# Altium schematic sheet mem.SchDoc
size A
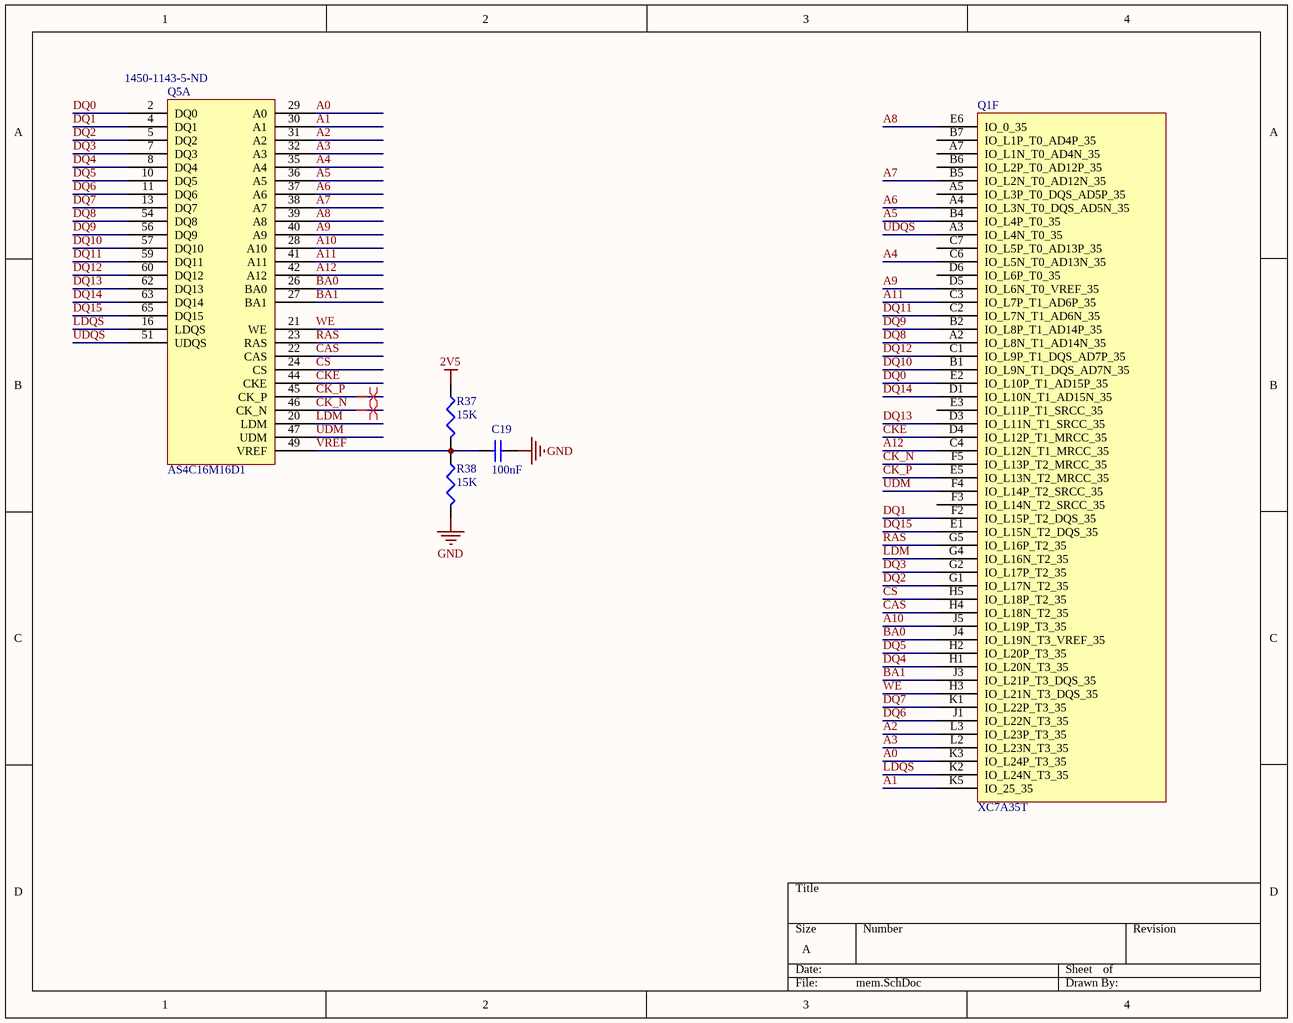
[diagram p0: mem.SchDoc]

## Parts
C19  value 100nF  [CAPC1005X06L]  (hidden comment: Cap)
Q1  XC7A35T  (part F of 6)
Q5  AS4C16M16D1  Supplier Part Number 1: 1450-1143-5-ND  [TSOP65P1180X120-66N]  (part A of 2)
R37  value 15K  [CAPC1608X90N]  (hidden comment: Res3)
R38  value 15K  [CAPC1608X90N]  (hidden comment: Res3)

## Nets
2V5: R37.1
GND: C19.2 R38.2
A0: Q1.K3(IO_L24P_T3_35) Q5.29(A0)
A1: Q1.K5(IO_25_35) Q5.30(A1)
A2: Q1.L3(IO_L23P_T3_35) Q5.31(A2)
A3: Q1.L2(IO_L23N_T3_35) Q5.32(A3)
A4: Q1.C6(IO_L5N_T0_AD13N_35) Q5.35(A4)
A5: Q1.B4(IO_L4P_T0_35) Q5.36(A5)
A6: Q1.A4(IO_L3N_T0_DQS_AD5N_35) Q5.37(A6)
A7: Q1.B5(IO_L2N_T0_AD12N_35) Q5.38(A7)
A8: Q1.E6(IO_0_35) Q5.39(A8)
A9: Q1.D5(IO_L6N_T0_VREF_35) Q5.40(A9)
A10: Q1.J5(IO_L19P_T3_35) Q5.28(A10)
A11: Q1.C3(IO_L7P_T1_AD6P_35) Q5.41(A11)
A12: Q1.C4(IO_L12N_T1_MRCC_35) Q5.42(A12)
BA0: Q1.J4(IO_L19N_T3_VREF_35) Q5.26(BA0)
BA1: Q1.J3(IO_L21P_T3_DQS_35) Q5.27(BA1)
CAS: Q1.H4(IO_L18N_T2_35) Q5.22(CAS)
CK_N: Q1.F5(IO_L13P_T2_MRCC_35) Q5.46(CK_N)
CK_P: Q1.E5(IO_L13N_T2_MRCC_35) Q5.45(CK_P)
CKE: Q1.D4(IO_L12P_T1_MRCC_35) Q5.44(CKE)
CS: Q1.H5(IO_L18P_T2_35) Q5.24(CS)
DQ0: Q1.E2(IO_L10P_T1_AD15P_35) Q5.2(DQ0)
DQ1: Q1.F2(IO_L15P_T2_DQS_35) Q5.4(DQ1)
DQ2: Q1.G1(IO_L17N_T2_35) Q5.5(DQ2)
DQ3: Q1.G2(IO_L17P_T2_35) Q5.7(DQ3)
DQ4: Q1.H1(IO_L20N_T3_35) Q5.8(DQ4)
DQ5: Q1.H2(IO_L20P_T3_35) Q5.10(DQ5)
DQ6: Q1.J1(IO_L22N_T3_35) Q5.11(DQ6)
DQ7: Q1.K1(IO_L22P_T3_35) Q5.13(DQ7)
DQ8: Q1.A2(IO_L8N_T1_AD14N_35) Q5.54(DQ8)
DQ9: Q1.B2(IO_L8P_T1_AD14P_35) Q5.56(DQ9)
DQ10: Q1.B1(IO_L9N_T1_DQS_AD7N_35) Q5.57(DQ10)
DQ11: Q1.C2(IO_L7N_T1_AD6N_35) Q5.59(DQ11)
DQ12: Q1.C1(IO_L9P_T1_DQS_AD7P_35) Q5.60(DQ12)
DQ13: Q1.D3(IO_L11N_T1_SRCC_35) Q5.62(DQ13)
DQ14: Q1.D1(IO_L10N_T1_AD15N_35) Q5.63(DQ14)
DQ15: Q1.E1(IO_L15N_T2_DQS_35) Q5.65(DQ15)
LDM: Q1.G4(IO_L16N_T2_35) Q5.20(LDM)
LDQS: Q1.K2(IO_L24N_T3_35) Q5.16(LDQS)
RAS: Q1.G5(IO_L16P_T2_35) Q5.23(RAS)
UDM: Q1.F4(IO_L14P_T2_SRCC_35) Q5.47(UDM)
UDQS: Q1.A3(IO_L4N_T0_35) Q5.51(UDQS)
VREF: C19.1 Q5.49(VREF) R37.2 R38.1
WE: Q1.H3(IO_L21N_T3_DQS_35) Q5.21(WE)

Not connected (* = marked no-connect by the designer): Q1 A5(IO_L3P_T0_DQS_AD5P_35) A7(IO_L1N_T0_AD4N_35) B6(IO_L2P_T0_AD12P_35) B7(IO_L1P_T0_AD4P_35) C7(IO_L5P_T0_AD13P_35) D6(IO_L6P_T0_35) E3(IO_L11P_T1_SRCC_35) F3(IO_L14N_T2_SRCC_35)

## Layout directives
differential pair: CK_N, CK_P

## Library data of the parts
C19 = Cap: Capacitor; Published: 8-Jun-2000; LatestRevisionDate: 17-Jul-2002; LatestRevisionNote: Re-released for DXP Platform.; PackageReference: RAD-0.3; Publisher: Altium Limited; PackageDescription: Radial Cap, Thru-Hole; 2 Leads; 0.3 in Pin Spacing
Q5 = DDR256: Supplier 1: Digi-Key
R37 R38 = Res3: Resistor; Published: 8-Jun-2000; LatestRevisionDate: 29-May-2009; LatestRevisionNote: IPC-7351 Footprint Added.; PackageReference: J1-0603; Publisher: Altium Limited; PackageDescription: Chip Resistor; Supplier 1: Digi-Key; Supplier Part Number 1: 1276-4758-1-ND